# Altium project ZenSystemKart.PrjPcb
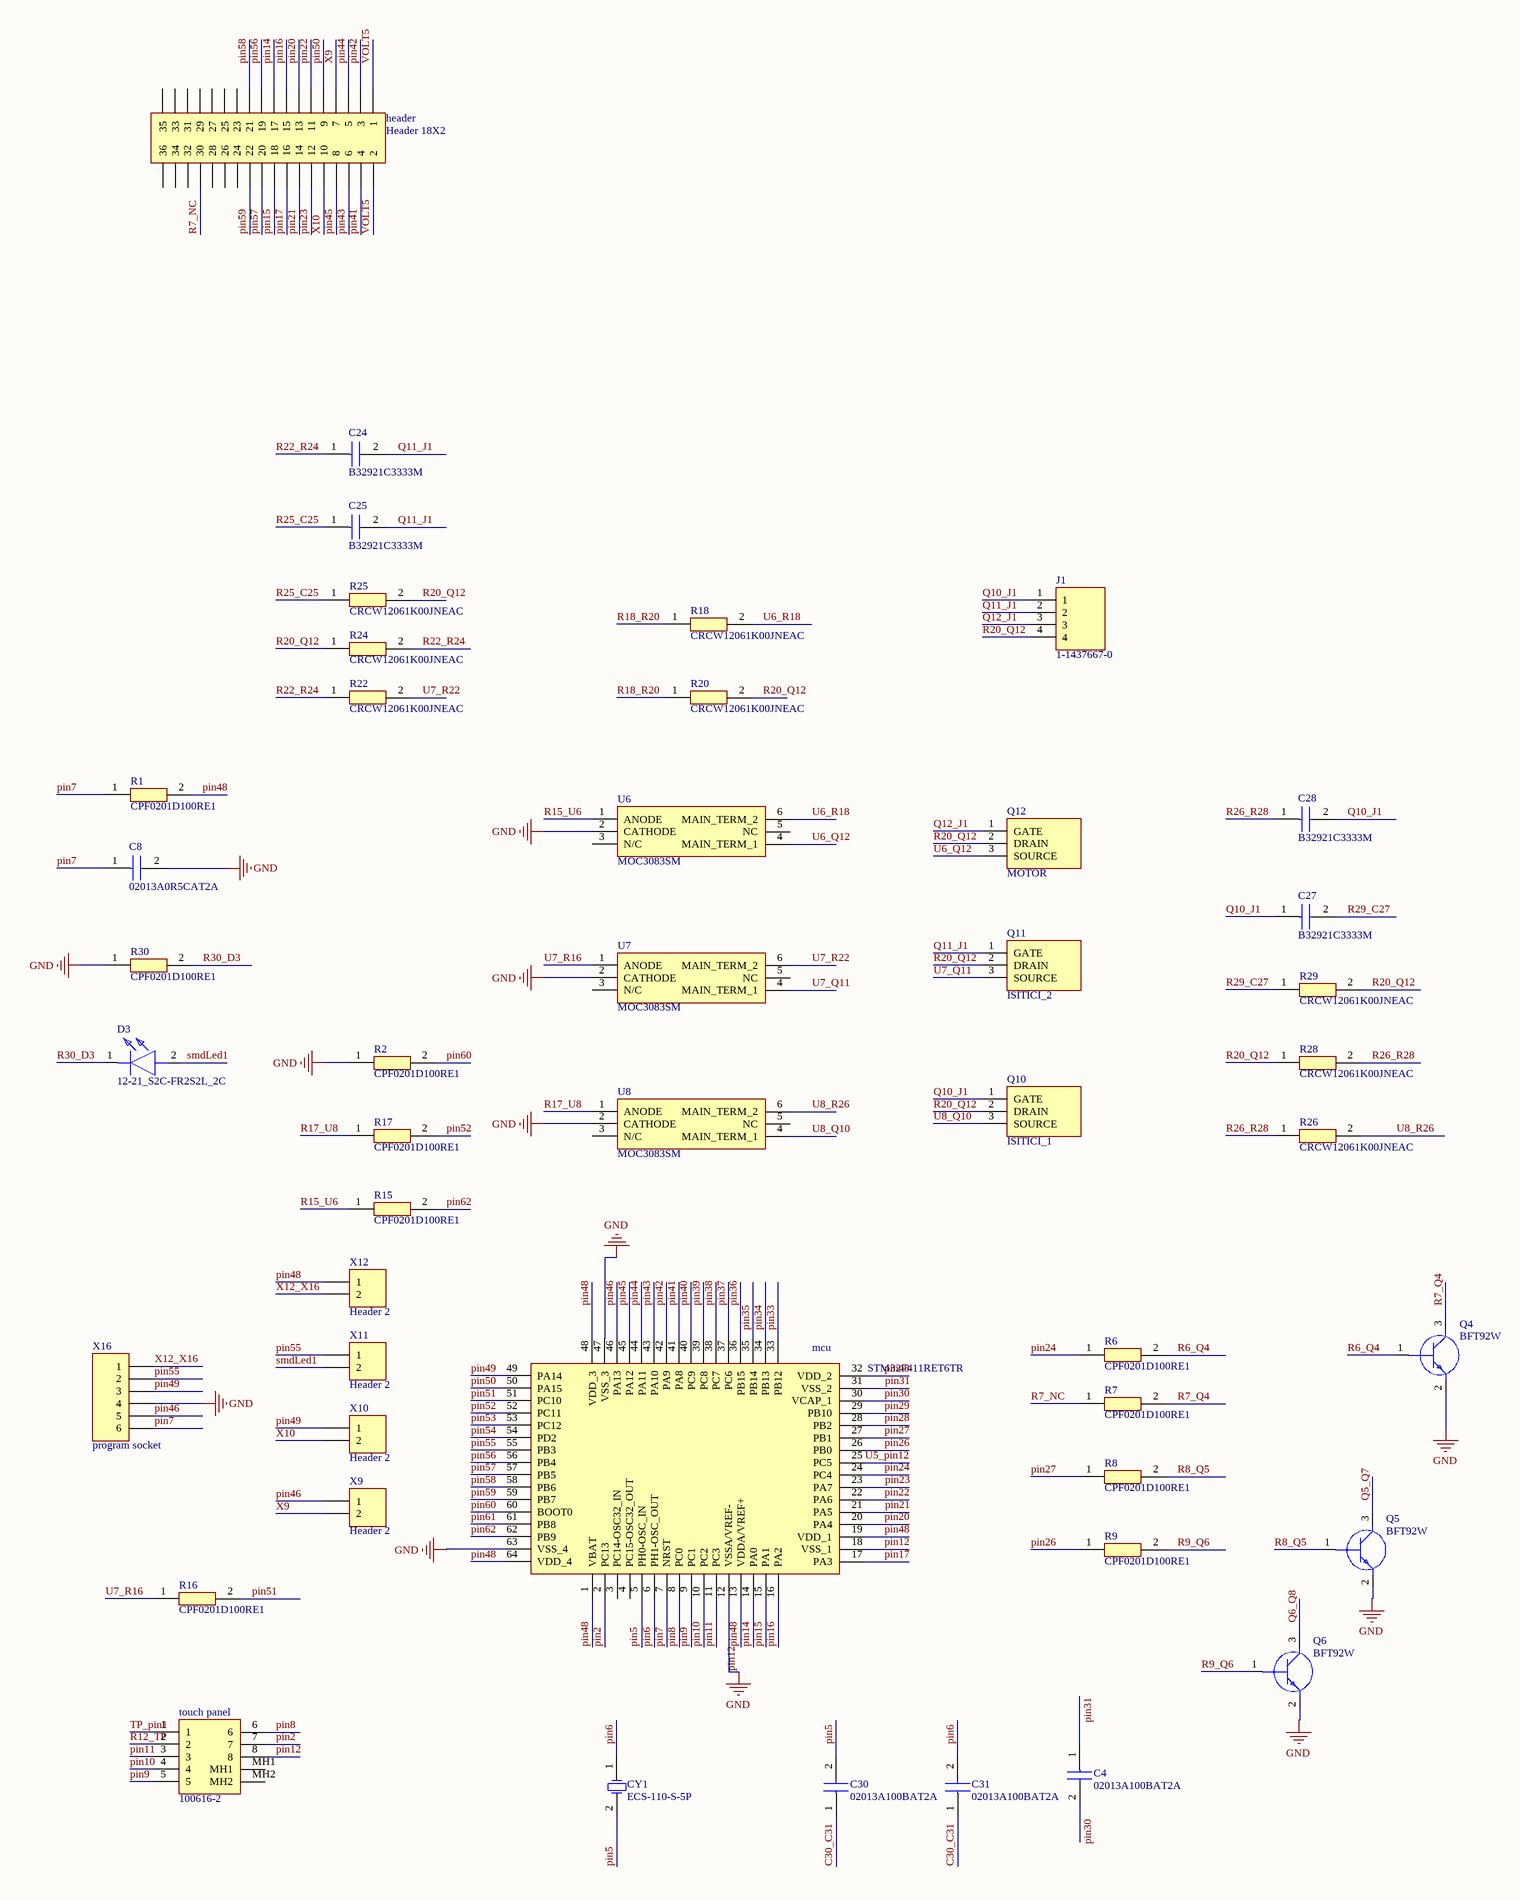
[diagram p0: Sheet1.SchDoc, left]
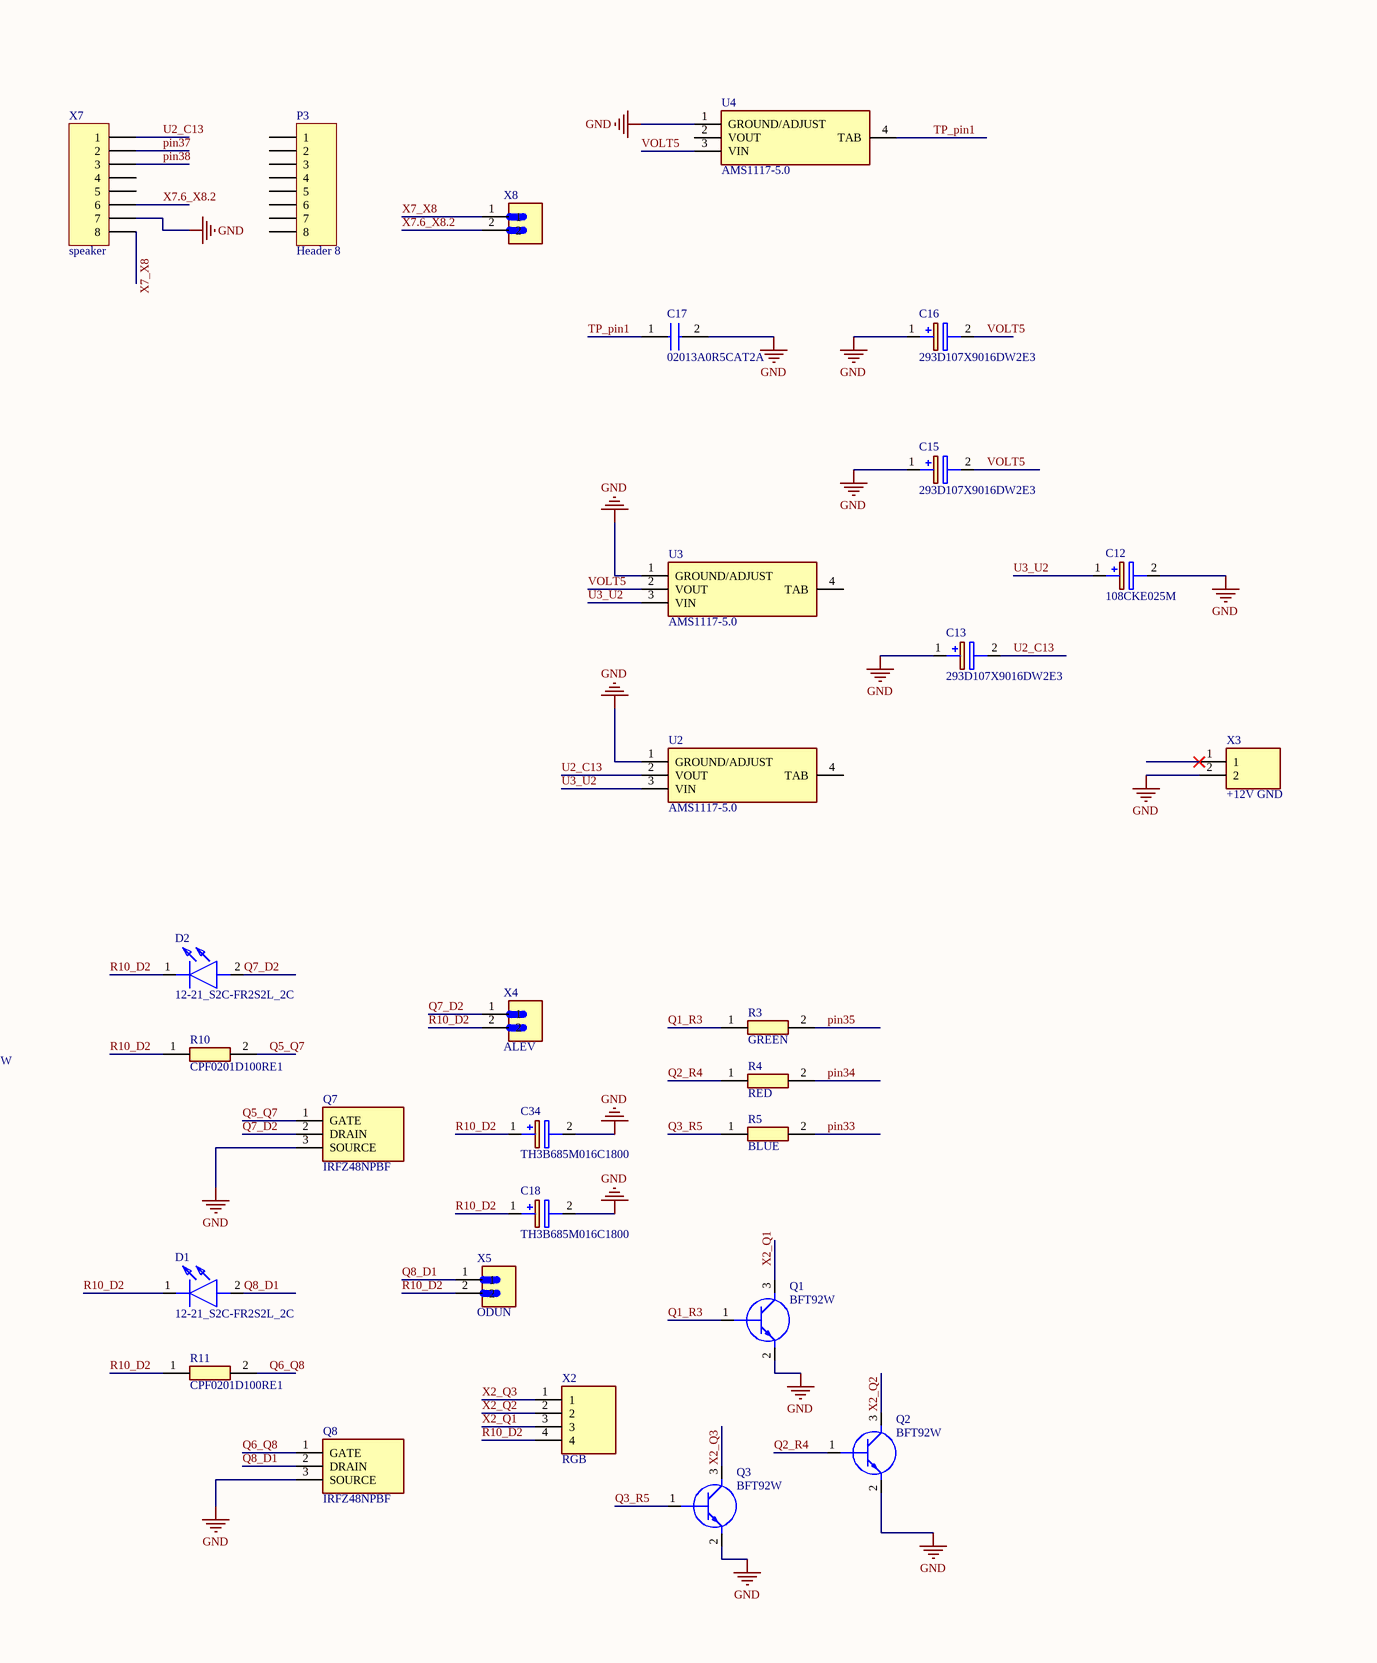
[diagram p1: Sheet1.SchDoc, middle]
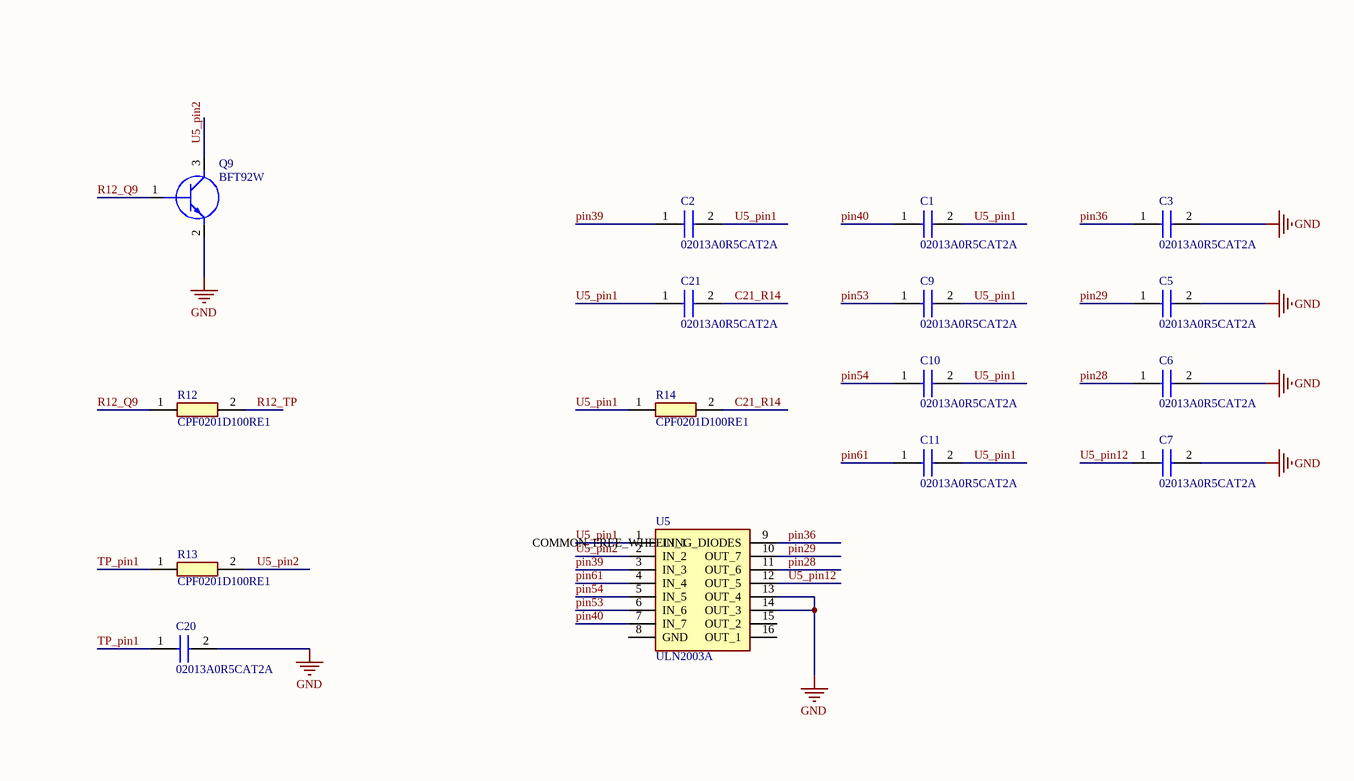
[diagram p2: Sheet1.SchDoc, right]
1 sheet, 91 parts. Net scope: global (net labels, ports and power ports of the same name join across sheets).
Board file: PCB1.PcbDoc

## Sheet Sheet1.SchDoc
size E; SheetNumber: 1; SheetTotal: 1

### Parts
C1  02013A0R5CAT2A  [CAPC0603X33N]
C2  02013A0R5CAT2A  [CAPC0603X33N]
C3  02013A0R5CAT2A  [CAPC0603X33N]
C4  02013A100BAT2A  [CAPC0603X33N]
C5  02013A0R5CAT2A  [CAPC0603X33N]
C6  02013A0R5CAT2A  [CAPC0603X33N]
C7  02013A0R5CAT2A  [CAPC0603X33N]
C8  02013A0R5CAT2A  [CAPC0603X33N]
C9  02013A0R5CAT2A  [CAPC0603X33N]
C10  02013A0R5CAT2A  [CAPC0603X33N]
C11  02013A0R5CAT2A  [CAPC0603X33N]
C12  108CKE025M  [CAPPRD550W60D1050H2150]
C13  293D107X9016DW2E3  [CAPPM7343X310N]
C15  293D107X9016DW2E3  [CAPPM7343X310N]
C16  293D107X9016DW2E3  [CAPPM7343X310N]
C17  02013A0R5CAT2A  [CAPC0603X33N]
C18  TH3B685M016C1800  [CAPPM3528X210N]
C20  02013A0R5CAT2A  [CAPC0603X33N]
C21  02013A0R5CAT2A  [CAPC0603X33N]
C24  B32921C3333M  [B32921C3333M]
C25  B32921C3333M  [B32921C3333M]
C27  B32921C3333M  [B32921C3333M]
C28  B32921C3333M  [B32921C3333M]
C30  02013A100BAT2A  [CAPC0603X33N]
C31  02013A100BAT2A  [CAPC0603X33N]
C34  TH3B685M016C1800  [CAPPM3528X210N]
CY1  ECS-110-S-5P  [CSM-7]
D1  12-21_S2C-FR2S2L_2C  [1221S2CFR2S2L2C]
D2  12-21_S2C-FR2S2L_2C  [1221S2CFR2S2L2C]
D3  12-21_S2C-FR2S2L_2C  [1221S2CFR2S2L2C]
header  Header 18X2  [HDR2X18]
J1  1-1437667-0  [114376670]
mcu  STM32F411RET6TR  [QFP50P1200X1200X160-64N]
P3  Header 8  [HDR1X8]
Q1  BFT92W  [SOT65P210X110-3N]
Q2  BFT92W  [SOT65P210X110-3N]
Q3  BFT92W  [SOT65P210X110-3N]
Q4  BFT92W  [SOT65P210X110-3N]
Q5  BFT92W  [SOT65P210X110-3N]
Q6  BFT92W  [SOT65P210X110-3N]
Q7  IRFZ48NPBF  [TO254P483X1016X1994-3P]
Q8  IRFZ48NPBF  [TO254P483X1016X1994-3P]
Q9  BFT92W  [SOT65P210X110-3N]
Q10  ISITICI_1  [TO254P483X1016X1994-3P]
Q11  ISITICI_2  [TO254P483X1016X1994-3P]
Q12  MOTOR  [TO254P483X1016X1994-3P]
R1  CPF0201D100RE1  [RESC0603X28N]
R2  CPF0201D100RE1  [RESC0603X28N]
R3  GREEN  [RESC0603X28N]
R4  RED  [RESC0603X28N]
R5  BLUE  [RESC0603X28N]
R6  CPF0201D100RE1  [RESC0603X28N]
R7  CPF0201D100RE1  [RESC0603X28N]
R8  CPF0201D100RE1  [RESC0603X28N]
R9  CPF0201D100RE1  [RESC0603X28N]
R10  CPF0201D100RE1  [RESC0603X28N]
R11  CPF0201D100RE1  [RESC0603X28N]
R12  CPF0201D100RE1  [RESC0603X28N]
R13  CPF0201D100RE1  [RESC0603X28N]
R14  CPF0201D100RE1  [RESC0603X28N]
R15  CPF0201D100RE1  [RESC0603X28N]
R16  CPF0201D100RE1  [RESC0603X28N]
R17  CPF0201D100RE1  [RESC0603X28N]
R18  CRCW12061K00JNEAC  [RESC3216X60N]
R20  CRCW12061K00JNEAC  [RESC3216X60N]
R22  CRCW12061K00JNEAC  [RESC3216X60N]
R24  CRCW12061K00JNEAC  [RESC3216X60N]
R25  CRCW12061K00JNEAC  [RESC3216X60N]
R26  CRCW12061K00JNEAC  [RESC3216X60N]
R28  CRCW12061K00JNEAC  [RESC3216X60N]
R29  CRCW12061K00JNEAC  [RESC3216X60N]
R30  CPF0201D100RE1  [RESC0603X28N]
touch_panel  100616-2  [1006162]
U2  AMS1117-5.0  [SOT229P700X180-4N]
U3  AMS1117-5.0  [SOT229P700X180-4N]
U4  AMS1117-5.0  [SOT229P700X180-4N]
U5  ULN2003A  [DIP794W56P254L1888H533Q16N]
U6  MOC3083SM  [DIP762W51P254L851H508Q6N]
U7  MOC3083SM  [DIP762W51P254L851H508Q6N]
U8  MOC3083SM  [DIP762W51P254L851H508Q6N]
X2  RGB  [1844236]
X3  +12V GND  [SHDR2W100P0X508_1X2_1020X780X1200P]
X4  ALEV  [PHOENIX_1803277]
X5  ODUN  [PHOENIX_1803277]
X7  speaker  [HDR1X8]
X8  (no value)  [PHOENIX_1803277]
X9  Header 2  [HDR1X2]
X10  Header 2  [HDR1X2]
X11  Header 2  [HDR1X2]
X12  Header 2  [HDR1X2]
X16  program socket  [HDR1X6]

### Nets
pin12: C3.2 C5.2 C6.2 C7.2 C8.2 C12.2(-) C13.1(+) C15.1(+) C16.1(+) C17.2 C18.2(-) C20.2 C34.2(-) mcu.12(VSSA/VREF-) mcu.18(VSS_1) mcu.47(VSS_3) mcu.63(VSS_4) Q1.2(E) Q2.2(E) Q3.2(E) Q4.2(E) Q5.2(E) Q6.2(E) Q7.3(SOURCE) Q8.3(SOURCE) Q9.2(E) R2.1 R30.1 touch_panel.8 U2.1(GROUND/ADJUST) U3.1(GROUND/ADJUST) U4.1(GROUND/ADJUST) U5.13(OUT_4) U5.14(OUT_3) U6.2(CATHODE) U7.2(CATHODE) U8.2(CATHODE) X3.2 X7.7 X16.4  [also labelled GND]
C21_R14: C21.2 R14.2
C30_C31: C30.1 C31.1
pin2: mcu.2(PC13) touch_panel.7
pin5: C30.2 CY1.2(OSC2) mcu.5(PH0-OSC_IN)
pin6: C31.2 CY1.1(OSC1) mcu.6(PH1-OSC_OUT)
pin7: C8.1 mcu.7(NRST) R1.1 X16.6
pin8: mcu.8(PC0) touch_panel.6
pin9: mcu.9(PC1) touch_panel.5
pin10: mcu.10(PC2) touch_panel.4
pin11: mcu.11(PC3) touch_panel.3
pin14: header.17 mcu.14(PA0)
pin15: header.18 mcu.15(PA1)
pin16: header.15 mcu.16(PA2)
pin17: header.16 mcu.17(PA3)
pin20: header.13 mcu.20(PA4)
pin21: header.14 mcu.21(PA5)
pin22: header.11 mcu.22(PA6)
pin23: header.12 mcu.23(PA7)
pin24: mcu.24(PC4) R6.1
pin26: mcu.26(PB0) R9.1
pin27: mcu.27(PB1) R8.1
pin28: C6.1 mcu.28(PB2) U5.11(OUT_6)
pin29: C5.1 mcu.29(PB10) U5.10(OUT_7)
pin30: C4.2 mcu.30(VCAP_1)
pin31: C4.1 mcu.31(VSS_2)
pin33: mcu.33(PB12) R5.2
pin34: mcu.34(PB13) R4.2
pin35: mcu.35(PB14) R3.2
pin36: C3.1 mcu.36(PB15) U5.9(COMMON_FREE_WHEELING_DIODES)
pin37: mcu.37(PC6) X7.2
pin38: mcu.38(PC7) X7.3
pin39: C2.1 mcu.39(PC8) U5.3(IN_3)
pin40: C1.1 mcu.40(PC9) U5.7(IN_7)
pin41: header.4 mcu.41(PA8)
pin42: header.3 mcu.42(PA9)
pin43: header.6 mcu.43(PA10)
pin44: header.5 mcu.44(PA11)
pin45: header.8 mcu.45(PA12)
pin46: mcu.46(PA13) X9.1 X16.5
pin48: mcu.1(VBAT) mcu.13(VDDA/VREF+) mcu.19(VDD_1) mcu.32(VDD_2) mcu.48(VDD_3) mcu.64(VDD_4) R1.2 X12.1
pin49: mcu.49(PA14) X10.1 X16.3
pin50: header.9 mcu.50(PA15)
pin51: mcu.51(PC10) R16.2
pin52: mcu.52(PC11) R17.2
pin53: C9.1 mcu.53(PC12) U5.6(IN_6)
pin54: C10.1 mcu.54(PD2) U5.5(IN_5)
pin55: mcu.55(PB3) X11.1 X16.2
pin56: header.19 mcu.56(PB4)
pin57: header.20 mcu.57(PB5)
pin58: header.21 mcu.58(PB6)
pin59: header.22 mcu.59(PB7)
pin60: mcu.60(BOOT0) R2.2
pin61: C11.1 mcu.61(PB8) U5.4(IN_4)
pin62: mcu.62(PB9) R15.2
Q1_R3: Q1.1(B) R3.1
Q2_R4: Q2.1(B) R4.1
Q3_R5: Q3.1(B) R5.1
Q5_Q7: Q5.3(C) Q7.1(GATE) R10.2
Q6_Q8: Q6.3(C) Q8.1(GATE) R11.2
Q7_D2: D2.2(A) Q7.2(DRAIN) X4.1
Q8_D1: D1.2(A) Q8.2(DRAIN) X5.1
Q10_J1: C27.1 C28.2 J1.1 Q10.1(GATE)
Q11_J1: C24.2 C25.2 J1.2 Q11.1(GATE)
Q12_J1: J1.3 Q12.1(GATE)
R6_Q4: Q4.1(B) R6.2
R7_NC: header.30 R7.1
R7_Q4: Q4.3(C) R7.2
R8_Q5: Q5.1(B) R8.2
R9_Q6: Q6.1(B) R9.2
R10_D2: C18.1(+) C34.1(+) D1.1(K) D2.1(K) R10.1 R11.1 X2.4 X4.2 X5.2
R12_Q9: Q9.1(B) R12.1
R12_TP: R12.2 touch_panel.2
R15_U6: R15.1 U6.1(ANODE)
R17_U8: R17.1 U8.1(ANODE)
R18_R20: R18.1 R20.1
R20_Q12: J1.4 Q10.2(DRAIN) Q11.2(DRAIN) Q12.2(DRAIN) R20.2 R24.1 R25.2 R28.1 R29.2
R22_R24: C24.1 R22.1 R24.2
R25_C25: C25.1 R25.1
R26_R28: C28.1 R26.1 R28.2
R29_C27: C27.2 R29.1
R30_D3: D3.1(K) R30.2
smdLed1: D3.2(A) X11.2
TP_pin1: C17.1 C20.1 R13.1 touch_panel.1 U4.4(TAB)
U2_C13: C13.2(-) U2.2(VOUT) X7.1
U3_U2: C12.1(+) U2.3(VIN) U3.3(VIN)
U5_pin1: C1.2 C2.2 C9.2 C10.2 C11.2 C21.1 R14.1 U5.1(IN_1)
U5_pin2: Q9.3(C) R13.2 U5.2(IN_2)
U5_pin12: C7.1 mcu.25(PC5) U5.12(OUT_5)
U6_Q12: Q12.3(SOURCE) U6.4(MAIN_TERM_1)
U6_R18: R18.2 U6.6(MAIN_TERM_2)
U7_Q11: Q11.3(SOURCE) U7.4(MAIN_TERM_1)
U7_R16: R16.1 U7.1(ANODE)
U7_R22: R22.2 U7.6(MAIN_TERM_2)
U8_Q10: Q10.3(SOURCE) U8.4(MAIN_TERM_1)
U8_R26: R26.2 U8.6(MAIN_TERM_2)
VOLT5: C15.2(-) C16.2(-) header.1 header.2 U3.2(VOUT) U4.3(VIN)
X2_Q1: Q1.3(C) X2.3
X2_Q2: Q2.3(C) X2.2
X2_Q3: Q3.3(C) X2.1
X7.6_X8.2: X7.6 X8.2
X7_X8: X7.8 X8.1
X9: header.7 X9.2
X10: header.10 X10.2
X12_X16: X12.2 X16.1

Not connected (* = marked no-connect by the designer): header 23 24 25 26 27 28 29 31 32 33 34 35 36; mcu 3(PC14-OSC32_IN) 4(PC15-OSC32_OUT); P3 1 2 3 4 5 6 7 8; touch_panel MH1 MH2; U2 4(TAB); U3 4(TAB); U4 2(VOUT); U5 8(GND) 15(OUT_2) 16(OUT_1); U6 3(N/C) 5(NC); U7 3(N/C) 5(NC); U8 3(N/C) 5(NC); X3 1*; X7 4 5

### Library data of the parts
C1-C3 C5-C11 C17 C20 C21 = 02013A0R5CAT2A: Capacitor; Manufacturer_Name: AVX; Datasheet Link: http://www.mouser.com/catalog/supplier/library/pdf/AVXSurfaceMountCeramic.pdf; Height: 0.33mm; Manufacturer_Part_Number: 02013A0R5CAT2A; Mouser Part Number: 581-02013A0R5C; Mouser Price/Stock: https://www.mouser.co.uk/ProductDetail/AVX/02013A0R5CAT2A?qs=Thry1QCnmXB3nXCuXCgVMw%3D%3D; Arrow Part Number: 02013A0R5CAT2A; Arrow Price/Stock: https://www.arrow.com/en/products/02013a0r5cat2a/avx
C4 C30 C31 = 02013A100BAT2A: Capacitor; Manufacturer_Name: AVX; Datasheet Link: http://www.mouser.com/catalog/supplier/library/pdf/AVXSurfaceMountCeramic.pdf; Height: 0.33mm; Manufacturer_Part_Number: 02013A100BAT2A; Mouser Part Number: 581-02013A100BAT2A; Mouser Price/Stock: https://www.mouser.com/Search/Refine.aspx?Keyword=581-02013A100BAT2A
C12 = 108CKE025M: Capacitor Polarised; Manufacturer_Name: Cinch Connectivity Solutions; Datasheet Link: https://componentsearchengine.com/Datasheets/2/108CKE025M.pdf; Height: 21.5mm; Manufacturer_Part_Number: 108CKE025M
C13 C15 C16 = 293D107X9016DW2E3: Capacitor Polarised; Manufacturer_Name: Vishay; Datasheet Link: http://www.vishay.com/docs/40002/293d.pdf; Height: 3.1mm; Manufacturer_Part_Number: 293D107X9016DW2E3
C18 C34 = TH3B685M016C1800: Capacitor Polarised; Manufacturer_Name: Vishay; Datasheet Link: http://www.vishay.com/doc?40084; Height: 2.1mm; Manufacturer_Part_Number: TH3B685M016C1800
C24 C25 C27 C28 = B32921C3333M: Capacitor; Manufacturer_Name: TDK; Datasheet Link: https://www.tdk-electronics.tdk.com/inf/20/20/db/fc_2009/X2_B32921_928.pdf; Height: 9mm; Manufacturer_Part_Number: B32921C3333M; Mouser Part Number: 871-B32921C3333M; Mouser Price/Stock: https://www.mouser.com/Search/Refine.aspx?Keyword=871-B32921C3333M; Arrow Part Number: B32921C3333M; Arrow Price/Stock: https://www.arrow.com/en/products/b32921c3333m/epcos-tdk
CY1 = ECS-110-S-5P: Crystal Oscillator; Published: 17-Jul-2002; DatasheetDocument: 18-Apr-2000; PackageReference: CSM-7; Publisher: Altium Limited; ComponentLink1Description: Manufacturer Link; ComponentLink1URL: http://www.ecsxtal.com/; ComponentLink2Description: Datasheet; ComponentLink2URL: http://www.ecsxtal.com/pdf3/CSM_7.pdf
D1-D3 = 12-21_S2C-FR2S2L_2C: LED; Manufacturer_Name: EVERLIGHT ELECTRONICS; Manufacturer_Part_Number: 12-21/S2C-FR2S2L/2C; Datasheet Link: https://datasheet.lcsc.com/szlcsc/1901141904_Everlight-Elec-12-21-S2C-FR2S2L-2C_C183856.pdf; Height: 2.2mm
header = Header 18X2: Header, 18-Pin, Dual row; LatestRevisionDate: 17-Jul-2002; LatestRevisionNote: Re-released for DXP Platform.; Publisher: Altium Limited
J1 = 1-1437667-0: Connector; Manufacturer_Name: TE Connectivity; Datasheet Link: http://uk.rs-online.com/web/p/products/8212655; Height: 13.97mm; Manufacturer_Part_Number: 1-1437667-0; Mouser Part Number: N/A; Mouser Price/Stock: https://www.mouser.com/Search/Refine.aspx?Keyword=N%2FA
mcu = STM32F411RET6TR: Integrated Circuit; Manufacturer_Name: STMicroelectronics; Datasheet Link: https://www.st.com/resource/en/datasheet/stm32f411re.pdf; Height: 1.6mm; Manufacturer_Part_Number: STM32F411RET6TR; Mouser Part Number: 511-STM32F411RET6TR; Mouser Price/Stock: https://www.mouser.co.uk/ProductDetail/STMicroelectronics/STM32F411RET6TR?qs=BA62vJVifGpaf6czDatkOw%3D%3D; Arrow Part Number: STM32F411RET6TR; Arrow Price/Stock: https://www.arrow.com/en/products/stm32f411ret6tr/stmicroelectronics?region=nac
P3 X7 = Header 8: Header, 8-Pin; LatestRevisionDate: 17-Jul-2002; LatestRevisionNote: Re-released for DXP Platform.; Publisher: Altium Limited
Q1-Q6 Q9 = BFT92W: Transistor BJT NPN; Manufacturer_Name: NXP; Datasheet Link: http://uk.rs-online.com/web/p/products/3803228; Height: 1.1mm; Manufacturer_Part_Number: BFT92W; Mouser Part Number: N/A; Mouser Price/Stock: https://www.mouser.co.uk/ProductDetail/NXP-Semiconductors/BFT92W/?qs=fAHHVMwC%252BbirqGt1esWTqQ%3D%3D
Q7 Q8 Q10-Q12 = IRFZ48NPBF: Transistor; Manufacturer_Name: Infineon; Datasheet Link: https://componentsearchengine.com/Datasheets/2/IRFZ48NPBF.pdf; Height: 4.83mm; Manufacturer_Part_Number: IRFZ48NPBF; Mouser Part Number: 942-IRFZ48NPBF; Mouser Price/Stock: https://www.mouser.co.uk/ProductDetail/Infineon-IR/IRFZ48NPBF?qs=9%252BKlkBgLFf0aUlYGH00miQ%3D%3D; Arrow Part Number: IRFZ48NPBF; Arrow Price/Stock: https://www.arrow.com/en/products/irfz48npbf/infineon-technologies-ag?region=nac
R1-R17 R30 = CPF0201D100RE1: Resistor; Manufacturer_Name: TE Connectivity; Datasheet Link: http://www.te.com/commerce/DocumentDelivery/DDEController?Action=showdoc&DocId=Data+Sheet%7F1773200-1%7FA%7Fpdf%7FEnglish%7FENG_DS_1773200-1_A.pdf%7F4-2176215-6; Height: 0.28mm; Manufacturer_Part_Number: CPF0201D100RE1; Mouser Part Number: 279-CPF0201D100RE1; Mouser Price/Stock: https://www.mouser.co.uk/ProductDetail/TE-Connectivity-Holsworthy/CPF0201D100RE1?qs=gt1LBUVyoHlmoWock10t3Q%3D%3D; Arrow Part Number: CPF0201D100RE1; Arrow Price/Stock: https://www.arrow.com/en/products/cpf0201d100re1/te-connectivity?region=nac
R18 R20 R22 R24-R26 R28 R29 = CRCW12061K00JNEAC: Resistor; Manufacturer_Name: Vishay; Datasheet Link: http://componentsearchengine.com/Datasheets/1/CRCW12061K00JNEAC.pdf; Height: 0.6mm; Manufacturer_Part_Number: CRCW12061K00JNEAC; Mouser Part Number: 71-CRCW12061K00JNEAC; Mouser Price/Stock: https://www.mouser.co.uk/ProductDetail/Vishay-Dale/CRCW12061K00JNEAC?qs=E3Y5ESvWgWPIcSNZLfmhag%3D%3D; Arrow Part Number: CRCW12061K00JNEAC; Arrow Price/Stock: https://www.arrow.com/en/products/crcw12061k00jneac/vishay?region=nac
touch_panel = 100616-2: Connector; Manufacturer_Name: TE Connectivity; Datasheet Link: http://www.te.com/commerce/DocumentDelivery/DDEController?Action=showdoc&DocId=Customer+Drawing%7F100616%7FP%7Fpdf%7FEnglish%7FENG_CD_100616_P.pdf%7F100616-2; Height: 16mm; Manufacturer_Part_Number: 100616-2; Mouser Part Number: 571-100616-2; Mouser Price/Stock: https://www.mouser.co.uk/ProductDetail/TE-Connectivity/100616-2?qs=dNLUg1dAArz2vweU495O%2FQ%3D%3D; Arrow Part Number: 100616-2; Arrow Price/Stock: https://www.arrow.com/en/products/100616-2/te-connectivity?region=nac
U2-U4 = AMS1117-5.0: Integrated Circuit; Manufacturer_Name: Advanced Monolithic Systems; Datasheet Link: http://www.advanced-monolithic.com/pdf/ds1117.pdf; Height: 1.8mm; Manufacturer_Part_Number: AMS1117-5.0
U5 = ULN2003A: Integrated Circuit; Manufacturer_Name: STMicroelectronics; Datasheet Link: http://www.st.com/web/en/resource/technical/document/datasheet/CD00001244.pdf; Height: 5.33mm; Manufacturer_Part_Number: ULN2003A; Mouser Part Number: 511-ULN2003A; Mouser Price/Stock: https://www.mouser.co.uk/ProductDetail/STMicroelectronics/ULN2003A?qs=FOlmdCx%252BAA1P2avu3tWCRw%3D%3D; Arrow Part Number: ULN2003A; Arrow Price/Stock: https://www.arrow.com/en/products/uln2003a/stmicroelectronics?region=nac
U6-U8 = MOC3083SM: Integrated Circuit; Manufacturer_Name: ON Semiconductor; Datasheet Link: https://datasheet.datasheetarchive.com/originals/distributors/Datasheets_SAMA/5a20506ac1f500cd6310533ed5733ab7.pdf; Height: 5.08mm; Manufacturer_Part_Number: MOC3083SM; Mouser Part Number: 512-MOC3083SM; Mouser Price/Stock: https://www.mouser.co.uk/ProductDetail/ON-Semiconductor-Fairchild/MOC3083SM?qs=D3DIWr27d5uvu753vimOug%3D%3D; Arrow Part Number: MOC3083SM; Arrow Price/Stock: https://www.arrow.com/en/products/moc3083sm/on-semiconductor
X2 = 1844236: Connector; Manufacturer_Name: Phoenix Contact; Datasheet Link: http://www.phoenixcontact.com/gb/produkte/1844236; Height: 8.25mm; Manufacturer_Part_Number: 1844236; Mouser Part Number: 651-1844236; Mouser Price/Stock: https://www.mouser.co.uk/ProductDetail/Phoenix-Contact/1844236?qs=DAHzmYU9cu1YEny1XwXz6g%3D%3D; Arrow Part Number: 1844236; Arrow Price/Stock: https://www.arrow.com/en/products/1844236/phoenix-contact
X3 = CTBP9308_2AO: Connector; Manufacturer_Name: CAMDENBOSS; Manufacturer_Part_Number: CTBP9308/2AO; Datasheet Link: https://componentsearchengine.com/Datasheets/2/CTBP9308_2AO.pdf; Height: 12mm
X4 X5 X8 = 1803277: 2 Position Terminal Block Header, Male Pins, Shrouded _4 Side_ 0.150 _3.81mm_ 90Â°, Right Angle Through Hole; MF: Phoenix Contact; Digi-Key_Purchase_URL: https://www.digikey.com/product-detail/en/phoenix-contact/1803277/277-1206-ND/260574?utm_source=snapeda&utm_medium=aggregator&utm_campaign=symbol; Digi-Key_Part_Number: 277-1206-ND; Package: FakePackage N; MP: 1803277; Value: *; SnapEDA_Link: https://www.snapeda.com/parts/1803277/Phoenix%20Contact/view-part/115436/?ref=snap
X9-X12 = Header 2: Header, 2-Pin; LatestRevisionDate: 17-Jul-2002; LatestRevisionNote: Re-released for DXP Platform.; Publisher: Altium Limited
X16 = Header 6: Header, 6-Pin; LatestRevisionDate: 17-Jul-2002; LatestRevisionNote: Re-released for DXP Platform.; Publisher: Altium Limited